# Altium schematic sheet TamagotchiMainBoard.SchDoc
size A2
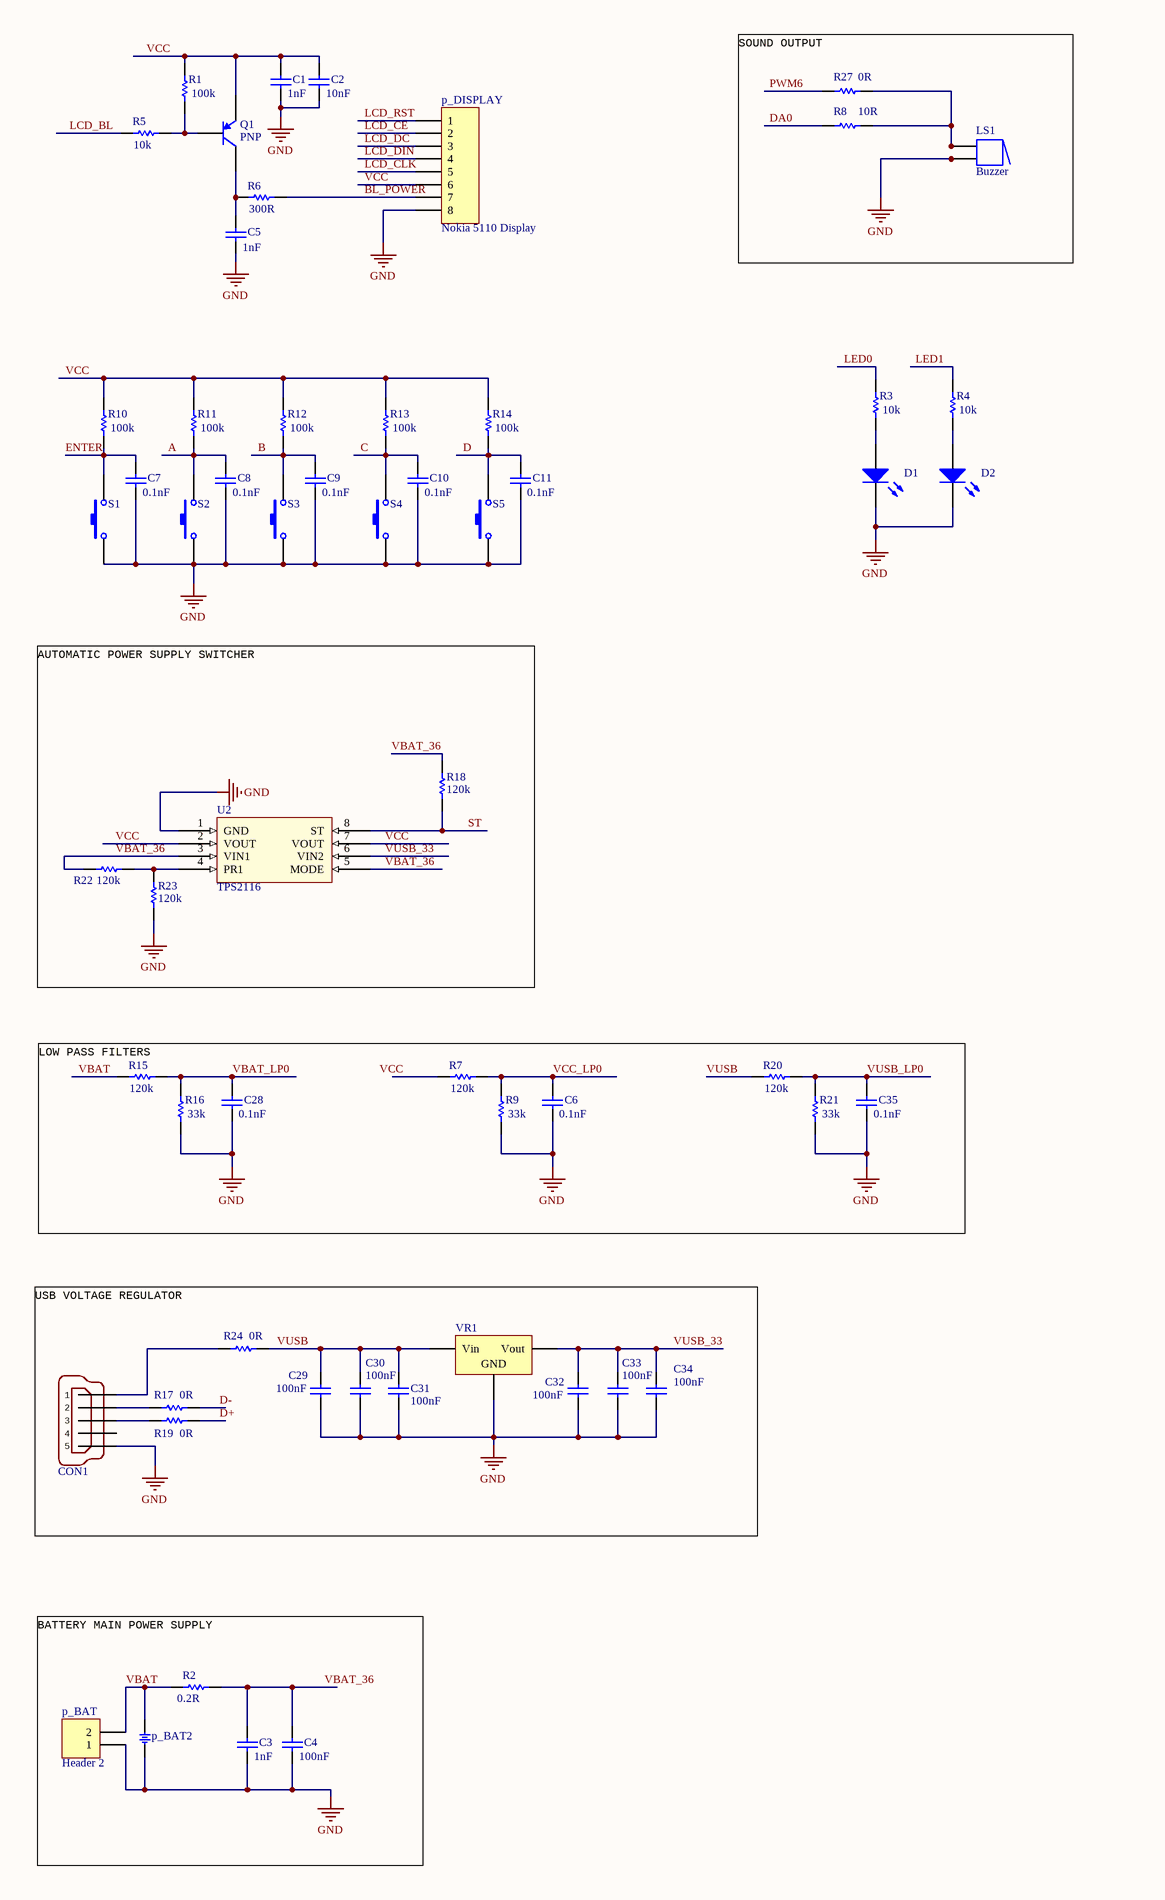
[diagram p0: TamagotchiMainBoard.SchDoc, left]
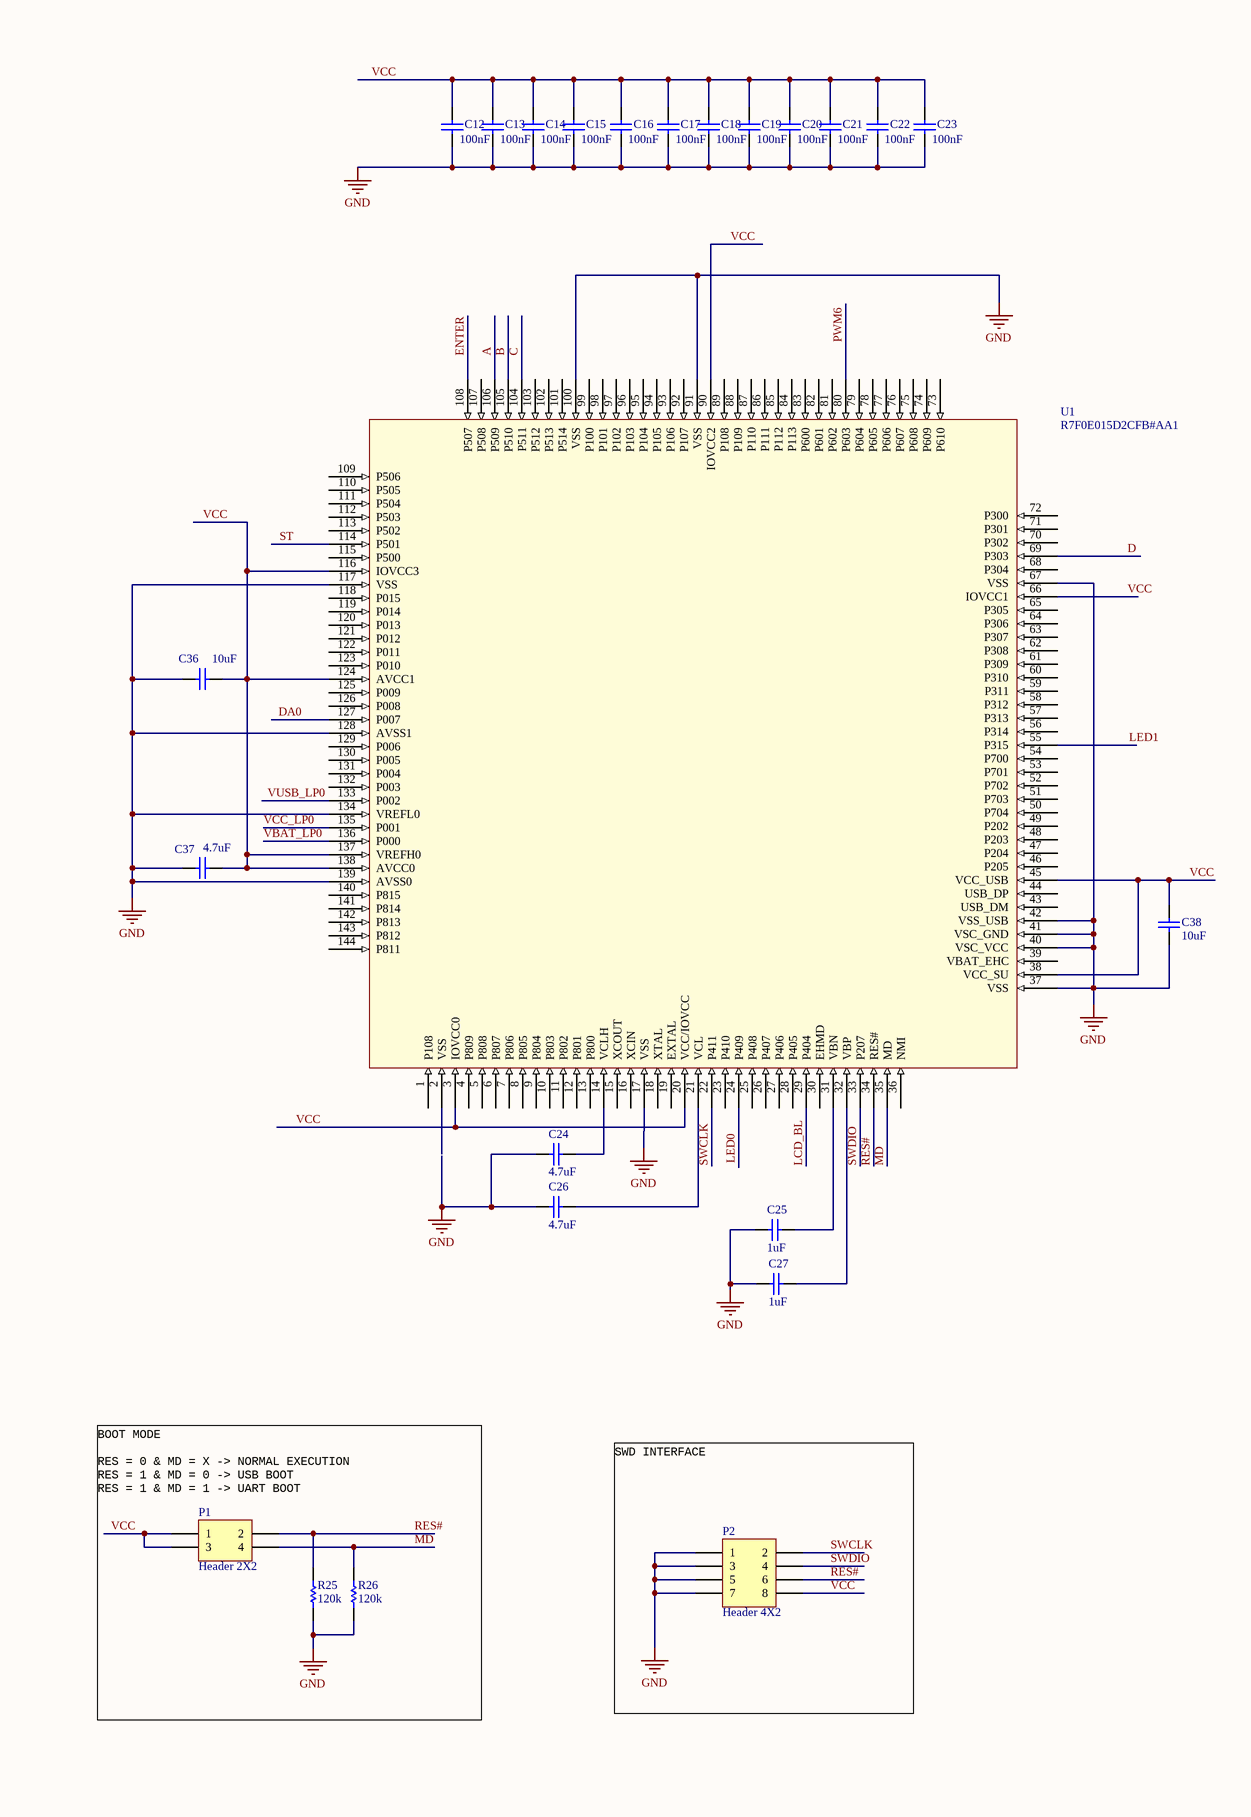
[diagram p1: TamagotchiMainBoard.SchDoc, right]

## Parts
C1  value 1nF  [C0805]  (hidden comment: Cap)
C2  value 10nF  [C0805]  (hidden comment: Cap)
C3  value 1nF  [C0805]  (hidden comment: Cap)
C4  value 100nF  [C0805]  (hidden comment: Cap)
C5  value 1nF  [C0805]  (hidden comment: Cap)
C6  value 0.1nF  [C0805]  (hidden comment: Cap)
C7  value 0.1nF  [C0805]  (hidden comment: Cap)
C8  value 0.1nF  [C0805]  (hidden comment: Cap)
C9  value 0.1nF  [C0805]  (hidden comment: Cap)
C10  value 0.1nF  [C0805]  (hidden comment: Cap)
C11  value 0.1nF  [C0805]  (hidden comment: Cap)
C12  value 100nF  [C0805]  (hidden comment: Cap)
C13  value 100nF  [C0805]  (hidden comment: Cap)
C14  value 100nF  [C0805]  (hidden comment: Cap)
C15  value 100nF  [C0805]  (hidden comment: Cap)
C16  value 100nF  [C0805]  (hidden comment: Cap)
C17  value 100nF  [C0805]  (hidden comment: Cap)
C18  value 100nF  [C0805]  (hidden comment: Cap)
C19  value 100nF  [C0805]  (hidden comment: Cap)
C20  value 100nF  [C0805]  (hidden comment: Cap)
C21  value 100nF  [C0805]  (hidden comment: Cap)
C22  value 100nF  [C0805]  (hidden comment: Cap)
C23  value 100nF  [C0805]  (hidden comment: Cap)
C24  value 4.7uF  [C1206]  (hidden comment: Cap)
C25  value 1uF  [C0805]  (hidden comment: Cap)
C26  value 4.7uF  [C1206]  (hidden comment: Cap)
C27  value 1uF  [C0805]  (hidden comment: Cap)
C28  value 0.1nF  [C0805]  (hidden comment: Cap)
C29  value 100nF  [C0805]  (hidden comment: Cap)
C30  value 100nF  [C0805]  (hidden comment: Cap)
C31  value 100nF  [C0805]  (hidden comment: Cap)
C32  value 100nF  [C0805]  (hidden comment: Cap)
C33  value 100nF  [C0805]  (hidden comment: Cap)
C34  value 100nF  [C0805]  (hidden comment: Cap)
C35  value 0.1nF  [C0805]  (hidden comment: Cap)
C36  value 10uF  [C1206]  (hidden comment: Cap)
C37  value 4.7uF  [C1206]  (hidden comment: Cap)
C38  value 10uF  [C1206]  (hidden comment: Cap)
CON1  897-43-005-00-100001  [USB-MINI-B-5P-SMD]  (value not drawn)
D1  LED0  [6-0805_M]  (value not drawn)
D2  LED0  [6-0805_M]  (value not drawn)
LS1  Buzzer  [HDR1X2]
P1  Header 2X2  [HDR2X2]
P2  Header 4X2  [HDR2X4]
p_BAT  Header 2  [HDR1X2]
p_BAT2  (no value)  [BTH2032]
p_DISPLAY  Nokia 5110 Display  [HDR1X8]
Q1  PNP  [SOT-23B_N]
R1  value 100k  [6-0805_M]  (hidden comment: Res1)
R2  value 0.2R  [6-0805_M]  (hidden comment: Res1)
R3  value 10k  [6-0805_M]  (hidden comment: Res1)
R4  value 10k  [6-0805_M]  (hidden comment: Res1)
R5  value 10k  [6-0805_M]  (hidden comment: Res1)
R6  value 300R  [6-0805_M]  (hidden comment: Res1)
R7  value 120k  [6-0805_M]  (hidden comment: Res1)
R8  value 10R  [6-0805_M]  (hidden comment: Res1)
R9  value 33k  [6-0805_M]  (hidden comment: Res1)
R10  value 100k  [6-0805_M]  (hidden comment: Res1)
R11  value 100k  [6-0805_M]  (hidden comment: Res1)
R12  value 100k  [6-0805_M]  (hidden comment: Res1)
R13  value 100k  [6-0805_M]  (hidden comment: Res1)
R14  value 100k  [6-0805_M]  (hidden comment: Res1)
R15  value 120k  [6-0805_M]  (hidden comment: Res1)
R16  value 33k  [6-0805_M]  (hidden comment: Res1)
R17  0R  [6-0805_M]
R18  value 120k  [6-0805_M]  (hidden comment: Res1)
R19  0R  [6-0805_M]
R20  value 120k  [6-0805_M]  (hidden comment: Res1)
R21  value 33k  [6-0805_M]  (hidden comment: Res1)
R22  value 120k  [6-0805_M]  (hidden comment: Res1)
R23  value 120k  [6-0805_M]  (hidden comment: Res1)
R24  0R  [6-0805_M]
R25  value 120k  [6-0805_M]  (hidden comment: Res1)
R26  value 120k  [6-0805_M]  (hidden comment: Res1)
R27  value 0R  [6-0805_M]  (hidden comment: Res1)
S1  SW-PB  [SPST-2]  (value not drawn)
S2  SW-PB  [SPST-2]  (value not drawn)
S3  SW-PB  [SPST-2]  (value not drawn)
S4  SW-PB  [SPST-2]  (value not drawn)
S5  SW-PB  [SPST-2]  (value not drawn)
U1  R7F0E015D2CFB#AA1  [SQFP50P2200X2200X170-144N]
U2  TPS2116
VR1  Volt Reg  [D2PAK_N]  (value not drawn)

## Nets
GND: C1.1 C2.1 C3.1 C4.1 C5.1 C6.2 C7.2 C8.2 C9.2 C10.2 C11.2 C12.1 C13.1 C14.1 C15.1 C16.1 C17.1 C18.1 C19.1 C20.1 C21.1 C22.1 C23.1 C24.2 C25.1 C26.2 C27.1 C28.2 C29.1 C30.1 C31.1 C32.1 C33.1 C34.1 C35.2 C36.2 C37.2 C38.1 CON1.5 D1.2(K) D2.2(K) LS1.2 LS1.2A P2.1 P2.3 P2.5 P2.7 p_BAT.1 p_BAT2.2 p_DISPLAY.8 R9.2 R16.2 R21.2 R23.2 R25.2 R26.2 S1.1 S2.1 S3.1 S4.1 S5.1 U1.17(VSS) U1.37(VSS) U1.40(VSC_VCC) U1.41(VSC_GND) U1.42(VSS_USB) U1.67(VSS) U1.91(VSS) U1.100(VSS) U1.117(VSS) U1.128(AVSS1) U1.134(VREFL0) U1.139(AVSS0) U2.1(GND) VR1.2(GND)
A: C8.1 R11.2 S2.2 U1.106(P509)
B: C9.1 R12.2 S3.2 U1.105(P510)
BL_POWER: p_DISPLAY.7 R6.1
C: C10.1 R13.2 S4.2 U1.104(P511)
D: C11.1 R14.2 S5.2 U1.69(P303)
D+: R19.1
D-: R17.1
DA0: R8.1 U1.127(P007)
ENTER: C7.1 R10.2 S1.2 U1.108(P507)
LCD_BL: R5.2 U1.29(P404)
LCD_CE: p_DISPLAY.2
LCD_CLK: p_DISPLAY.5
LCD_DC: p_DISPLAY.3
LCD_DIN: p_DISPLAY.4
LCD_RST: p_DISPLAY.1
LED0: R3.1 U1.24(P409)
LED1: R4.1 U1.55(P315)
MD: P1.4 R26.1 U1.35(MD)
PWM6: R27.1 U1.80(P603)
RES#: P1.2 P2.6 R25.1 U1.34(RES#)
ST: R18.2 U1.114(P501) U2.8(ST)
SWCLK: P2.2 U1.22(P411)
SWDIO: P2.4 U1.33(P207)
VBAT: p_BAT.2 p_BAT2.1 R2.2 R15.2
VBAT_36: C3.2 C4.2 R2.1 R18.1 R22.1 U2.3(VIN1) U2.5(MODE)
VBAT_LP0: C28.1 R15.1 R16.1 U1.136(P000)
VCC: C1.2 C2.2 C12.2 C13.2 C14.2 C15.2 C16.2 C17.2 C18.2 C19.2 C20.2 C21.2 C22.2 C23.2 C36.1 C37.1 C38.2 P1.1 P1.3 P2.8 p_DISPLAY.6 Q1.3(E) R1.1 R10.1 R11.1 R12.1 R13.1 R14.1 U1.3(IOVCC0) U1.20(VCC/IOVCC) U1.38(VCC_SU) U1.45(VCC_USB) U1.66(IOVCC1) U1.90(IOVCC2) U1.116(IOVCC3) U1.124(AVCC1) U1.137(VREFH0) U1.138(AVCC0) U2.2(VOUT) U2.7(VOUT)
VCC_LP0: C6.1 R7.1 R9.1 U1.135(P001)
VUSB: C29.2 C30.2 C31.2 R20.2 R24.1 VR1.1(Vin)
VUSB_33: C32.2 C33.2 C34.2 U2.6(VIN2) VR1.3(Vout)
VUSB_LP0: C35.1 R20.1 R21.1 U1.133(P002)
NetC5_2: C5.2 Q1.1(C) R6.2
NetC24_1: C24.1 U1.14(VCLH)
NetC25_2: C25.2 U1.31(VBN)
NetC26_1: C26.1 U1.21(VCL)
NetC27_2: C27.2 U1.32(VBP)
NetCON1_1: CON1.1 R24.2
NetCON1_2: CON1.2 R17.2
NetCON1_3: CON1.3 R19.2
NetD1_1: D1.1(A) R3.2
NetD2_1: D2.1(A) R4.2
NetLS1_1: LS1.1 LS1.1A R8.2 R27.2
NetQ1_2: Q1.2(B) R1.2 R5.1
NetR22_2: R22.2 R23.1 U2.4(PR1)

Not connected (* = marked no-connect by the designer): CON1 4; R7 2; U1 1(P108) 2(VSS) 4(P809) 5(P808) 6(P807) 7(P806) 8(P805) 9(P804) 10(P803) 11(P802) 12(P801) 13(P800) 15(XCOUT) 16(XCIN) 18(XTAL) 19(EXTAL) 23(P410) 25(P408) 26(P407) 27(P406) 28(P405) 30(EHMD) 36(NMI) 39(VBAT_EHC) 43(USB_DM) 44(USB_DP) 46(P205) 47(P204) 48(P203) 49(P202) 50(P704) 51(P703) 52(P702) 53(P701) 54(P700) 56(P314) 57(P313) 58(P312) 59(P311) 60(P310) 61(P309) 62(P308) 63(P307) 64(P306) 65(P305) 68(P304) 70(P302) 71(P301) 72(P300) 73(P610) 74(P609) 75(P608) 76(P607) 77(P606) 78(P605) 79(P604) 81(P602) 82(P601) 83(P600) 84(P113) 85(P112) 86(P111) 87(P110) 88(P109) 89(P108) 92(P107) 93(P106) 94(P105) 95(P104) 96(P103) 97(P102) 98(P101) 99(P100) 101(P514) 102(P513) 103(P512) 107(P508) 109(P506) 110(P505) 111(P504) 112(P503) 113(P502) 115(P500) 118(P015) 119(P014) 120(P013) 121(P012) 122(P011) 123(P010) 125(P009) 126(P008) 129(P006) 130(P005) 131(P004) 132(P003) 140(P815) 141(P814) 142(P813) 143(P812) 144(P811)

## Notes on the sheet
- SOUND OUTPUT
- AUTOMATIC POWER SUPPLY SWITCHER
- LOW PASS FILTERS
- USB VOLTAGE REGULATOR
- BOOT MODE
  RES = 0 & MD = X -> NORMAL EXECUTION
  RES = 1 & MD = 0 -> USB BOOT
  RES = 1 & MD = 1 -> UART BOOT
- (near P2) SWD INTERFACE
- BATTERY MAIN POWER SUPPLY
- Labels drawn without touching a wire or pin: VCC

## Library data of the parts
C1-C38 = Cap: Capacitor; Published: 8-Jun-2000; LatestRevisionDate: 17-Jul-2002; LatestRevisionNote: Re-released for DXP Platform.; PackageReference: RAD-0.3; Publisher: Altium Limited; PackageDescription: Radial Cap, Thru-Hole; 2 Leads; 0.3 in Pin Spacing
CON1 = MINI-USB-32005-201: Connector,MiniUSB B port,5 position,Right Angle,Gold flash 30u,black,SMD; Manufacturer: MILL-MAX; Embest PN: 1009007100067; Value: 897-43-005-00-100001; Part Type: USB Connector; Manufacturer Part Number: 897-43-005-00-100001
D1 D2 = LED0: Typical INFRARED GaAs LED; Published: 8-Jun-2000; LatestRevisionDate: 08-Jul-2005; LatestRevisionNote: Mech Layer 1 removed.; PackageReference: LED-0; Publisher: Altium Limited; PackageDescription: LED; 2 Leads
LS1 = Buzzer: Magnetic Transducer Buzzer; Published: 24-Mar-1999; LatestRevisionDate: 17-Dec-2003; LatestRevisionNote: Schematic revised, PCB Footprint replaced.; DatasheetVersion: 17-Dec-2003; PackageReference: ABSM-1574; Publisher: Altium Limited; PackageDescription: Magnetic Transducer Buzzer; ComponentLink1Description: Manufacturer Link; ComponentLink1URL: http://www.megastar.com/linecard/buzzmode/index.php
P1 = Header 2X2: Header, 2-Pin, Dual row; LatestRevisionDate: 17-Jul-2002; LatestRevisionNote: Re-released for DXP Platform.; Publisher: Altium Limited
P2 = Header 4X2: Header, 4-Pin, Dual row; LatestRevisionDate: 17-Jul-2002; LatestRevisionNote: Re-released for DXP Platform.; Publisher: Altium Limited
p_BAT = Header 2: Header, 2-Pin; LatestRevisionDate: 17-Jul-2002; LatestRevisionNote: Re-released for DXP Platform.; Publisher: Altium Limited
p_BAT2 = BATH_CR2032: BATTERY HOLDER, CR2032; MANF_P#: -; .: http://www.chila.ir
p_DISPLAY = Header 8: Header, 8-Pin; LatestRevisionDate: 17-Jul-2002; LatestRevisionNote: Re-released for DXP Platform.; Publisher: Altium Limited
Q1 = PNP: PNP Bipolar Transistor; Published: 8-Jun-2000; LatestRevisionDate: 29-May-2009; LatestRevisionNote: IPC-7351 Footprint Added.; PackageVersion: Aug-1999; PackageReference: SOT-23B; Publisher: Altium Limited; PackageDescription: 3-Pin SOT-23 Package 0.95 mm Pitch, 2.4 mm Lead Span
R1-R16 R18 R20-R23 R25-R27 = Res1: Resistor; Published: 8-Jun-2000; LatestRevisionDate: 17-Jul-2002; LatestRevisionNote: Re-released for DXP Platform.; PackageReference: AXIAL-0.3; Publisher: Altium Limited; PackageDescription: Axial Device, Thru-Hole; 2 Leads; 0.3 in Pin Spacing
R17 R19 R24 = Res1: Resistor; Value: 0.2R; Published: 8-Jun-2000; LatestRevisionDate: 17-Jul-2002; LatestRevisionNote: Re-released for DXP Platform.; PackageReference: AXIAL-0.3; Publisher: Altium Limited; PackageDescription: Axial Device, Thru-Hole; 2 Leads; 0.3 in Pin Spacing
S1-S5 = SW-PB: Switch; Published: 24-Mar-1999; LatestRevisionDate: 17-Jul-2002; LatestRevisionNote: Re-released for DXP Platform.; PackageReference: SPST-2; Publisher: Altium Limited; PackageDescription: Switch; 2 Leads
U1 = R7F0E015D2CFB#AA1: ARM® Cortex®-M0+ series Microcontroller IC 32-Bit 24MHz 1.5MB (1.5M x 8) FLASH 144-LFQFP (20x20)
U2 = TPS2116: TPS2116 1.6 V to 5.5 V, 2.5-A Low IQ Power Mux with Manual and Priority Switchover
VR1 = Volt Reg: Voltage Regulator; Published: 24-Mar-1999; LatestRevisionDate: 29-May-2009; LatestRevisionNote: IPC-7351 Footprint Added.; PackageReference: D2PAK; Publisher: Altium Limited; PackageDescription: 3-Pin Transistor Outline Package 2.54 mm Pitch, 15.1 mm Lead Span